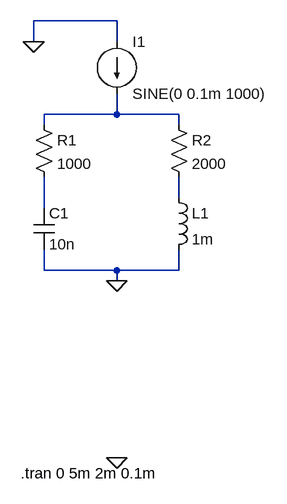
[diagram p0: schematic phase.asc]
phase.asc, the LTspice schematic file:
Version 4
SHEET 1 880 680
WIRE 240 -48 112 -48
WIRE 112 -16 112 -48
WIRE 240 -16 240 -48
WIRE 240 96 240 64
WIRE 240 96 128 96
WIRE 336 96 240 96
WIRE 128 112 128 96
WIRE 336 112 336 96
WIRE 336 224 336 192
WIRE 128 240 128 192
WIRE 128 336 128 304
WIRE 240 336 128 336
WIRE 336 336 336 304
WIRE 336 336 240 336
WIRE 240 352 240 336
FLAG 240 624 0
FLAG 240 352 0
FLAG 112 -16 0
SYMBOL res 112 96 R0
SYMATTR InstName R1
SYMATTR Value 1000
SYMBOL res 320 96 R0
SYMATTR InstName R2
SYMATTR Value 2000
SYMBOL cap 112 240 R0
SYMATTR InstName C1
SYMATTR Value 10n
SYMBOL ind 320 208 R0
SYMATTR InstName L1
SYMATTR Value 1m
SYMBOL current 240 -16 R0
WINDOW 123 0 0 Left 0
WINDOW 39 0 0 Left 0
SYMATTR InstName I1
SYMATTR Value SINE(0 0.1m 1000)
TEXT 92 648 Left 2 !.tran 0 5m 2m 0.1m

The netlist it stands for:
* phase.asc
R1 N001 N003 1000
R2 N001 N002 2000
C1 N003 0 10n
L1 N002 0 1m
I1 0 N001 SINE(0 0.1m 1000)
.tran 0 5m 2m 0.1m
.backanno
.end